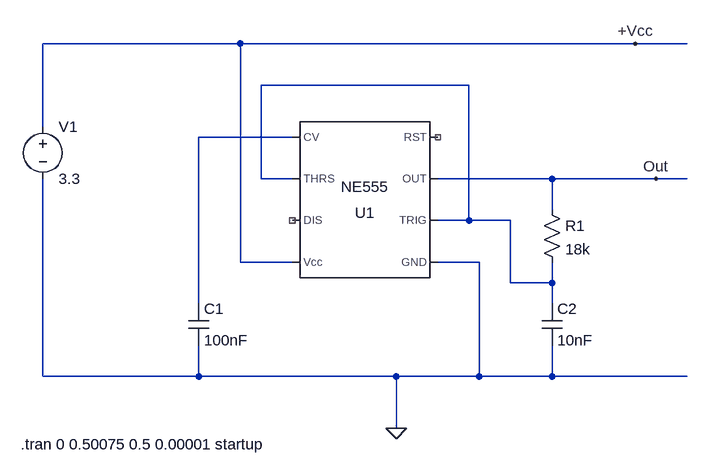
[diagram p0: schematic NE555_Astable_01.asc]
NE555_Astable_01.asc, the LTspice schematic file:
Version 4
SHEET 1 880 680
WIRE -32 -80 -336 -80
WIRE 576 -80 -32 -80
WIRE 656 -80 576 -80
WIRE 320 -16 0 -16
WIRE -336 48 -336 -80
WIRE 48 64 -96 64
WIRE 0 128 0 -16
WIRE 48 128 0 128
WIRE 448 128 272 128
WIRE 608 128 448 128
WIRE 656 128 608 128
WIRE 448 176 448 128
WIRE 320 192 320 -16
WIRE 320 192 272 192
WIRE 384 192 320 192
WIRE -32 256 -32 -80
WIRE 48 256 -32 256
WIRE 336 256 272 256
WIRE 384 288 384 192
WIRE 448 288 448 256
WIRE 448 288 384 288
WIRE -96 320 -96 64
WIRE 448 320 448 288
WIRE -336 432 -336 128
WIRE -96 432 -96 384
WIRE -96 432 -336 432
WIRE 208 432 -96 432
WIRE 336 432 336 256
WIRE 336 432 208 432
WIRE 448 432 448 384
WIRE 448 432 336 432
WIRE 656 432 448 432
WIRE 208 512 208 432
FLAG 208 512 0
FLAG 608 128 Out
FLAG 576 -80 +Vcc
SYMBOL Misc\\NE555 160 160 R180
SYMATTR InstName U1
SYMBOL cap -112 320 R0
SYMATTR InstName C1
SYMATTR Value 100nF
SYMBOL cap 432 320 R0
SYMATTR InstName C2
SYMATTR Value 10nF
SYMBOL res 432 160 R0
SYMATTR InstName R1
SYMATTR Value 18k
SYMBOL voltage -336 32 R0
WINDOW 123 0 0 Left 2
WINDOW 39 0 0 Left 2
SYMATTR InstName V1
SYMATTR Value 3.3
TEXT -370 536 Left 2 !.tran 0 0.50075 0.5 0.00001 startup

The netlist it stands for:
* NE555_Astable_01.asc
XU1 0 N001 Out NC_01 N002 N001 NC_02 +Vcc NE555  ; pins GND TRIG OUT RST CV THRS DIS Vcc
C1 N002 0 100nF
C2 N001 0 10nF
R1 Out N001 18k
V1 +Vcc 0 3.3
.tran 0 0.50075 0.5 0.00001 startup
.lib NE555.sub
.backanno
.end

* Results of the author's LTspice run, read from the files saved beside the schematic
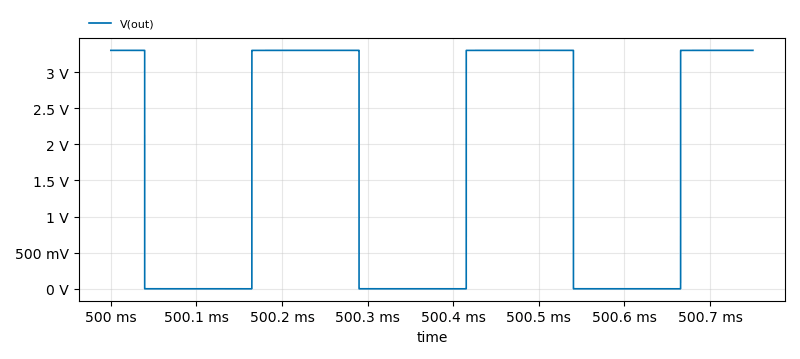
[diagram p1: Transient Analysis of NE555_Astable_01.asc, plotted from the saved traces]
* Transient Analysis, 1 run:
*   V(out): min 385.9 µV, max 3.3 V, average 1.647 V, rms 2.331 V, last 3.3 V